# EAGLE design raspi3_nonHat (EAGLE 9.4.1)
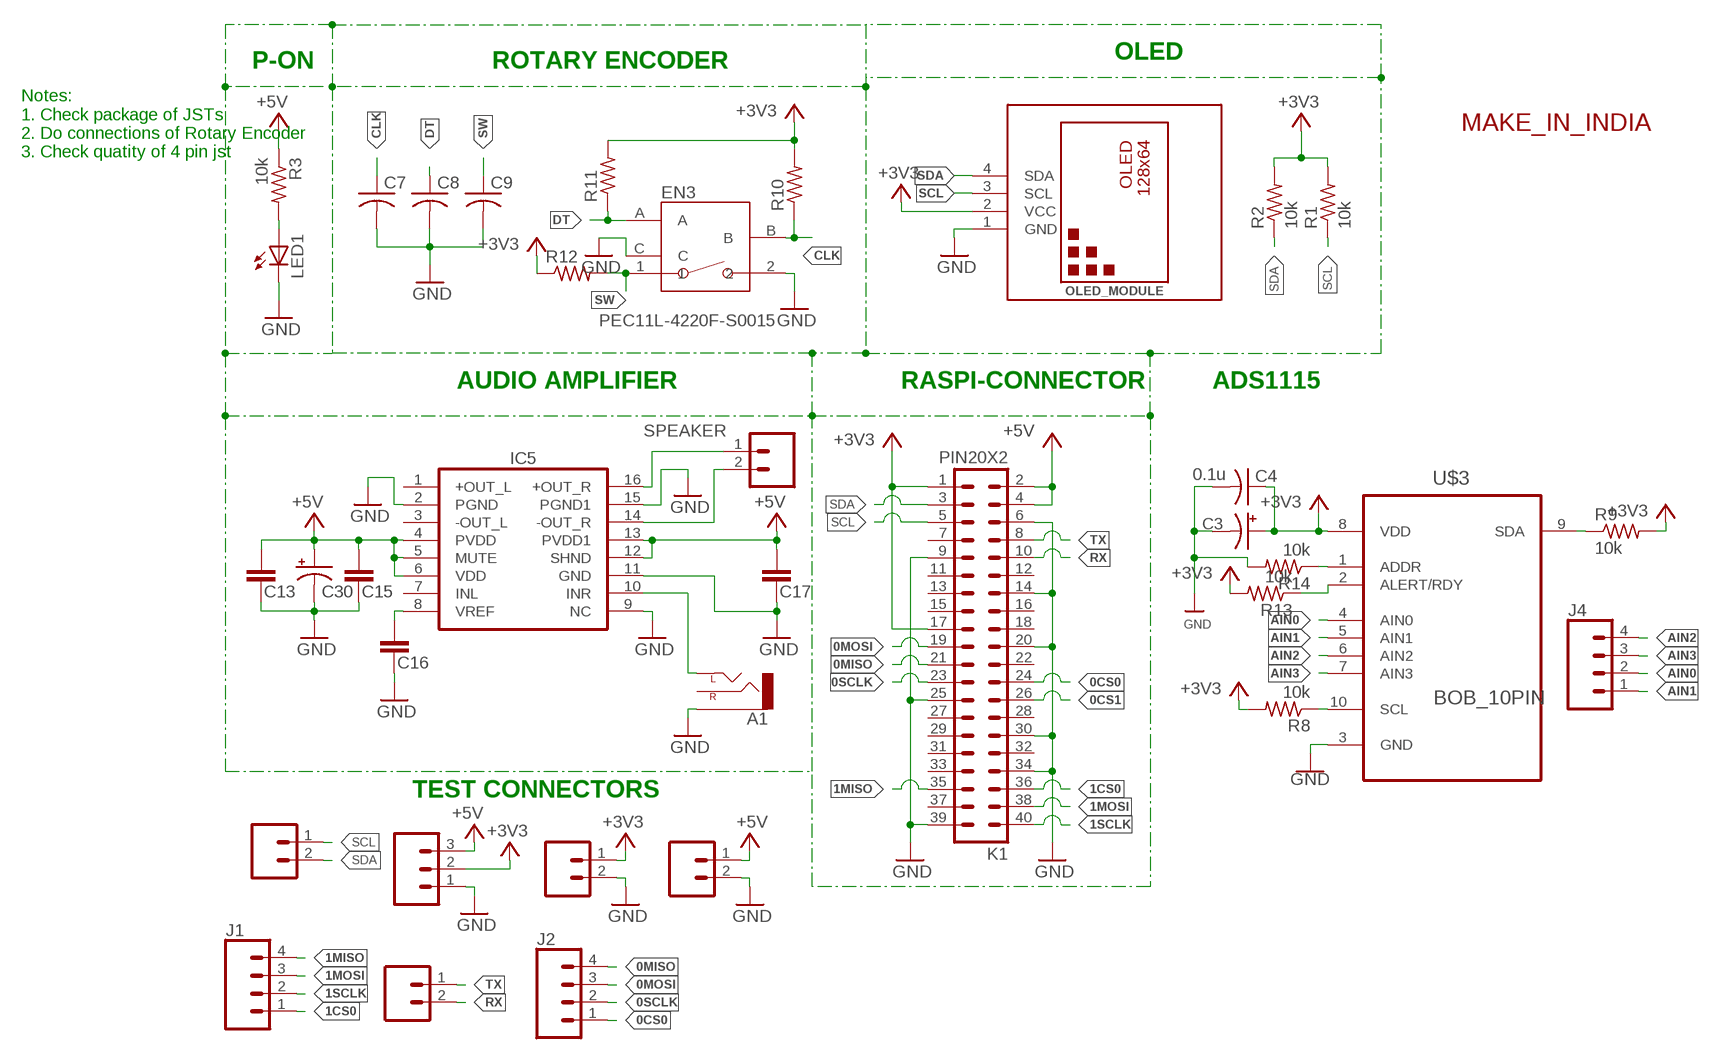
[diagram p0: schematic, sheet 1]

## Parts
A1  AUDIO-JACKPTH  [AUDIO-JACK]
C3  10u  CAP_POL_10V  [C/6032-28R]
C4  0.1u  CAP0805  [C0805]
C7  C-USC0603K  [C0603K]
C8  C-USC0603K  [C0603K]
C9  C-USC0603K  [C0603K]
C13  1uf  C-EUC1206  [C1206]
C15  1uf  C-EUC1206  [C1206]
C16  0.1uf  C-EUC1206  [C1206]
C17  1uf  C-EUC1206  [C1206]
C30  CAP_POL_10V  [C/6032-28R]
EN3  PEC11L-4220F-S0015  [PEC11L-4220F-S0015]
IC5  PAM8403  [SOP-16]
J1  CONN_04POLAR  [MOLEX-1X4]
J2  CONN_04POLAR  [MOLEX-1X4]
J4  CONN_04POLAR  [MOLEX-1X4]
K1  PIN20X2  [PIN_20X2]
LED1  LED3MM  [LED3MM]
OLED_MODULE  DIY-MODULES_DISPLAY-OLED-128X64-I2C  [DIY-MODULES_DISPLAY-OLED-128X64-I2C]
POWER  CONN_03POLAR  [MOLEX-1X3]
R1  10k  RESISTOR0207/7  [0207/7]
R2  10k  RESISTOR0207/7  [0207/7]
R3  10k  RESISTOR0207/7  [0207/7]
R8  10k  RESISTOR0603  [R0603]
R9  10k  RESISTOR0603  [R0603]
R10  R-US_M0805  [M0805]
R11  R-US_M0805  [M0805]
R12  R-US_M0805  [M0805]
R13  10k  RESISTOR0603  [R0603]
R14  10k  RESISTOR0603  [R0603]
SPEAKER  M02  [02P]
THERMISTOR1  CONN_02POLAR  [MOLEX-1X2]
THERMISTOR2  CONN_02POLAR  [MOLEX-1X2]
THERMISTOR3  CONN_02POLAR  [MOLEX-1X2]
THERMISTOR4  CONN_02POLAR  [MOLEX-1X2]
U$1  MAKE-IN-INDIA-LOGO  [MAKE-IN-INDIA]
U$3  BOB_10PIN  [BOB10]

## Nets
0CS0: J2.1 K1.24
0CS1: K1.26
0MISO: J2.4 K1.21
0MOSI: J2.3 K1.19
0SCLK: J2.2 K1.23
1CS0: J1.1 K1.36
1MISO: J1.4 K1.35
1MOSI: J1.3 K1.38
1SCLK: J1.2 K1.40
+3V3: C3.+ C4.1 K1.1 K1.17 OLED_MODULE.2(VCC) POWER.2 R1.2 R2.2 R8.2 R9.2 R10.2 R11.2 R12.1 R13.2 THERMISTOR2.1 U$3.8(VDD)
+5V: C13.1 C15.2 C17.2 C30.+ IC5.4(PVDD) IC5.5(MUTE) IC5.6(VDD) IC5.12(SHND) IC5.13(PVDD1) K1.2 K1.4 POWER.3 R3.1 THERMISTOR3.1
AIN0: J4.2 U$3.4(AIN0)
AIN1: J4.1 U$3.5(AIN1)
AIN2: J4.4 U$3.6(AIN2)
AIN3: J4.3 U$3.7(AIN3)
CLK: C7.1 EN3.B R10.1
DT: C8.1 EN3.A R11.1
GND: A1.SLEEVE C3.- C4.2 C7.2 C8.2 C9.2 C13.2 C15.1 C16.2 C17.1 C30.- EN3.2 EN3.C IC5.2(PGND) IC5.9(NC) IC5.11(GND) IC5.15(PGND1) K1.6 K1.9 K1.14 K1.20 K1.25 K1.30 K1.34 K1.39 LED1.K(C) OLED_MODULE.1(GND) POWER.1 R14.2 THERMISTOR2.2 THERMISTOR3.2 U$3.3(GND)
N$1: LED1.A R3.2
N$4: IC5.16(+OUT_R) SPEAKER.1
N$12: R8.1 U$3.10(SCL)
N$13: R9.1 U$3.9(SDA)
N$14: R13.1 U$3.2(ALERT/RDY)
N$15: R14.1 U$3.1(ADDR)
N$27: IC5.14(-OUT_R) SPEAKER.2
N$29: A1.TIP(LEFT) IC5.10(INR)
N$34: C16.1 IC5.8(VREF)
RX: K1.10 THERMISTOR4.2
SCL: K1.5 OLED_MODULE.3(SCL) R1.1 THERMISTOR1.1
SDA: K1.3 OLED_MODULE.4(SDA) R2.1 THERMISTOR1.2
SW: C9.1 EN3.1 R12.2
TX: K1.8 THERMISTOR4.1
Unconnected: A1.RING(RIGHT) IC5.1(+OUT_L) IC5.3(-OUT_L) IC5.7(INL) K1.7 K1.11 K1.12 K1.13 K1.15 K1.16 K1.18 K1.22 K1.27 K1.28 K1.29 K1.31 K1.32 K1.33 K1.37

## Notes on the sheet
- OLED
- P-ON | ROTARY ENCODER
- Notes:
  1. Check package of JSTs
  2. Do connections of Rotary Encoder
  3. Check quatity of 4 pin jst
- AUDIO AMPLIFIER | RASPI-CONNECTOR | ADS1115
- TEST CONNECTORS

## Library data of the parts
A1 = CEDT_JANUARY_2015_v5:AUDIO-JACK: 3.5mm Audio Jack Simple 3.5mm common PCB mount audio jack. SKU: PRT-08032
C3 = CEDT_JANUARY_2015_v5:CAP_POL
C4 = CEDT_JANUARY_2015_v5:CAP
C7-C9 = adafruit:C-US: CAPACITOR, American symbol
C13 C15-C17 = rcl:C-EU: CAPACITOR, European symbol
C30 = CEDT_SEPTEMBER_V2:CAP_POL
EN3 = Encoders:PEC11L-4220F-S0015: ROTARY ENCODER MECHANICAL 15PPR Manufacturer's datasheet <https://www.bourns.com/docs/Product-Datasheets/PEC11L.pdf>; CREATED_BY: PCBLayout.com; DIGIKEY_PARTNO: PEC11L-4220F-S0015-ND; MANUFACTURER: Bourns Inc.; MPN: PEC11L-4220F-S0015
IC5 = PAM8403:PAM8403: Dual channel audio amplifier IC - PAM8403
J1 J2 J4 = SparkFun-Connectors:CONN_04: Multi connection point. Often used as Generic Header-pin footprint for 0.1 inch spaced/style header connections On any of the 0.1 inch spaced packages, you can populate with these: Break Away Headers - Straight <https://www.sparkfun.com/products/116> (PRT-00116) Break Away Male Headers - Right Angle <https://www.sparkfun.com/products/553> (PRT-00553) Female Headers <https://www.sparkfun.com/products/115> (PRT-00115) Break Away Headers - Machine Pin <https://www.sparkfun.com/products/117> (PRT-00117) Break Away Female Headers - Swiss Machine Pin <https://www.sparkfun.com/products/743> (PRT-00743) For SCREWTERMINALS and SPRING TERMINALS visit here: Screw Terimnals on SparkFun.com <https://www.sparkfun.com/search/results?term=Screw+Terminals> (5mm/3.5mm/2.54mm spacing) This device is also useful as a general connection point to wire up your design to another part of your project. Our various solder wires solder well into these plated through hole pads. Hook-Up Wire - Assortment (Stranded, 22 AWG) <https://www.sparkfun.com/products/11375> (PRT-11375) Hook-Up Wire - Assortment (Solid Core, 22 AWG) <https://www.sparkfun.com/products/11367> (PRT-11367) View the entire wire category on our website here <https://www.sparkfun.com/categories/141> Special notes: Molex polarized connector foot print use with SKU : PRT-08231 with associated crimp pins and housings. 1MM SMD Version SKU: PRT-10208; PROD_ID: CONN-08186; SF_ID: PRT-08231
K1 = FLYFISH:PIN20X2
LED1 = CEDT_JANUARY_2015_v5:LED
OLED_MODULE = esp32_dev_kit_v14:DIY-MODULES_DISPLAY-OLED-128X64-I2C: 128x64 Dot Matrix OLED Module based on SSD1306 chip Variant with I2C interface More details available here: http://www.instructables.com/id/Monochrome-096-i2c-OLED-display-with-arduino-SSD13/ SSD1306 datasheet: https://cdn-shop.adafruit.com/datasheets/SSD1306.pdf Click here to find device on ebay.com <http://www.ebay.com/sch/oled+display+128x64+iic> Note: There are two variants: I2C and SPI. Search for the proper version.
POWER = SparkFun-Connectors:CONN_03: Multi connection point. Often used as Generic Header-pin footprint for 0.1 inch spaced/style header connections On any of the 0.1 inch spaced packages, you can populate with these: Break Away Headers - Straight <https://www.sparkfun.com/products/116> (PRT-00116) Break Away Male Headers - Right Angle <https://www.sparkfun.com/products/553> (PRT-00553) Female Headers <https://www.sparkfun.com/products/115> (PRT-00115) Break Away Headers - Machine Pin <https://www.sparkfun.com/products/117> (PRT-00117) Break Away Female Headers - Swiss Machine Pin <https://www.sparkfun.com/products/743> (PRT-00743) Stackable Header - 3 Pin (Female, 0.1") <https://www.sparkfun.com/products/13875> (PRT-13875) For SCREWTERMINALS and SPRING TERMINALS visit here: Screw Terimnals on SparkFun.com <https://www.sparkfun.com/search/results?term=Screw+Terminals> (5mm/3.5mm/2.54mm spacing) This device is also useful as a general connection point to wire up your design to another part of your project. Our various solder wires solder well into these plated through hole pads. Hook-Up Wire - Assortment (Stranded, 22 AWG) <https://www.sparkfun.com/products/11375> (PRT-11375) Hook-Up Wire - Assortment (Solid Core, 22 AWG) <https://www.sparkfun.com/products/11367> (PRT-11367) View the entire wire category on our website here <https://www.sparkfun.com/categories/141> Special notes: Molex polarized connector foot print use with SKU : PRT-08232 with associated crimp pins and housings.; PROD_ID: CONN-08625; SF_ID: PRT-08096
R1-R3 = CEDT:RESISTOR; OC_FARNELL: unknown
R8 R9 R13 R14 = CEDT_JANUARY_2015_v5:RESISTOR
R10-R12 = rcl:R-US_: RESISTOR, American symbol; SPICEPREFIX: R
SPEAKER = CEDT_JANUARY_2015_v5:M02: AMP QUICK CONNECTOR
THERMISTOR1-THERMISTOR4 = SparkFun-Connectors:CONN_02: Multi connection point. Often used as Generic Header-pin footprint for 0.1 inch spaced/style header connections On any of the 0.1 inch spaced packages, you can populate with these: Break Away Headers - Straight <https://www.sparkfun.com/products/116> (PRT-00116) Break Away Male Headers - Right Angle <https://www.sparkfun.com/products/553> (PRT-00553) Female Headers <https://www.sparkfun.com/products/115> (PRT-00115) Break Away Headers - Machine Pin <https://www.sparkfun.com/products/117> (PRT-00117) Break Away Female Headers - Swiss Machine Pin <https://www.sparkfun.com/products/743> (PRT-00743) For SCREWTERMINALS and SPRING TERMINALS visit here: Screw Terimnals on SparkFun.com <https://www.sparkfun.com/search/results?term=Screw+Terminals> (5mm/3.5mm/2.54mm spacing) This device is also useful as a general connection point to wire up your design to another part of your project. Our various solder wires solder well into these plated through hole pads. Hook-Up Wire - Assortment (Stranded, 22 AWG) <https://www.sparkfun.com/products/11375> (PRT-11375) Hook-Up Wire - Assortment (Solid Core, 22 AWG) <https://www.sparkfun.com/products/11367> (PRT-11367) View the entire wire category on our website here <https://www.sparkfun.com/categories/141> Special notes: Molex polarized connector foot print use with: PRT-08233 with associated crimp pins and housings. 2.54_SCREWTERM for use with PRT-10571. 3.5mm Screw Terminal footprints for PRT-08084 5mm Screw Terminal footprints for use with PRT-08432; SF_ID: PRT-09918
U$1 = namanpuri:MAKE-IN-INDIA-LOGO
U$3 = CEDT_JANUARY_2015_v5:BOB_10PIN

## Board
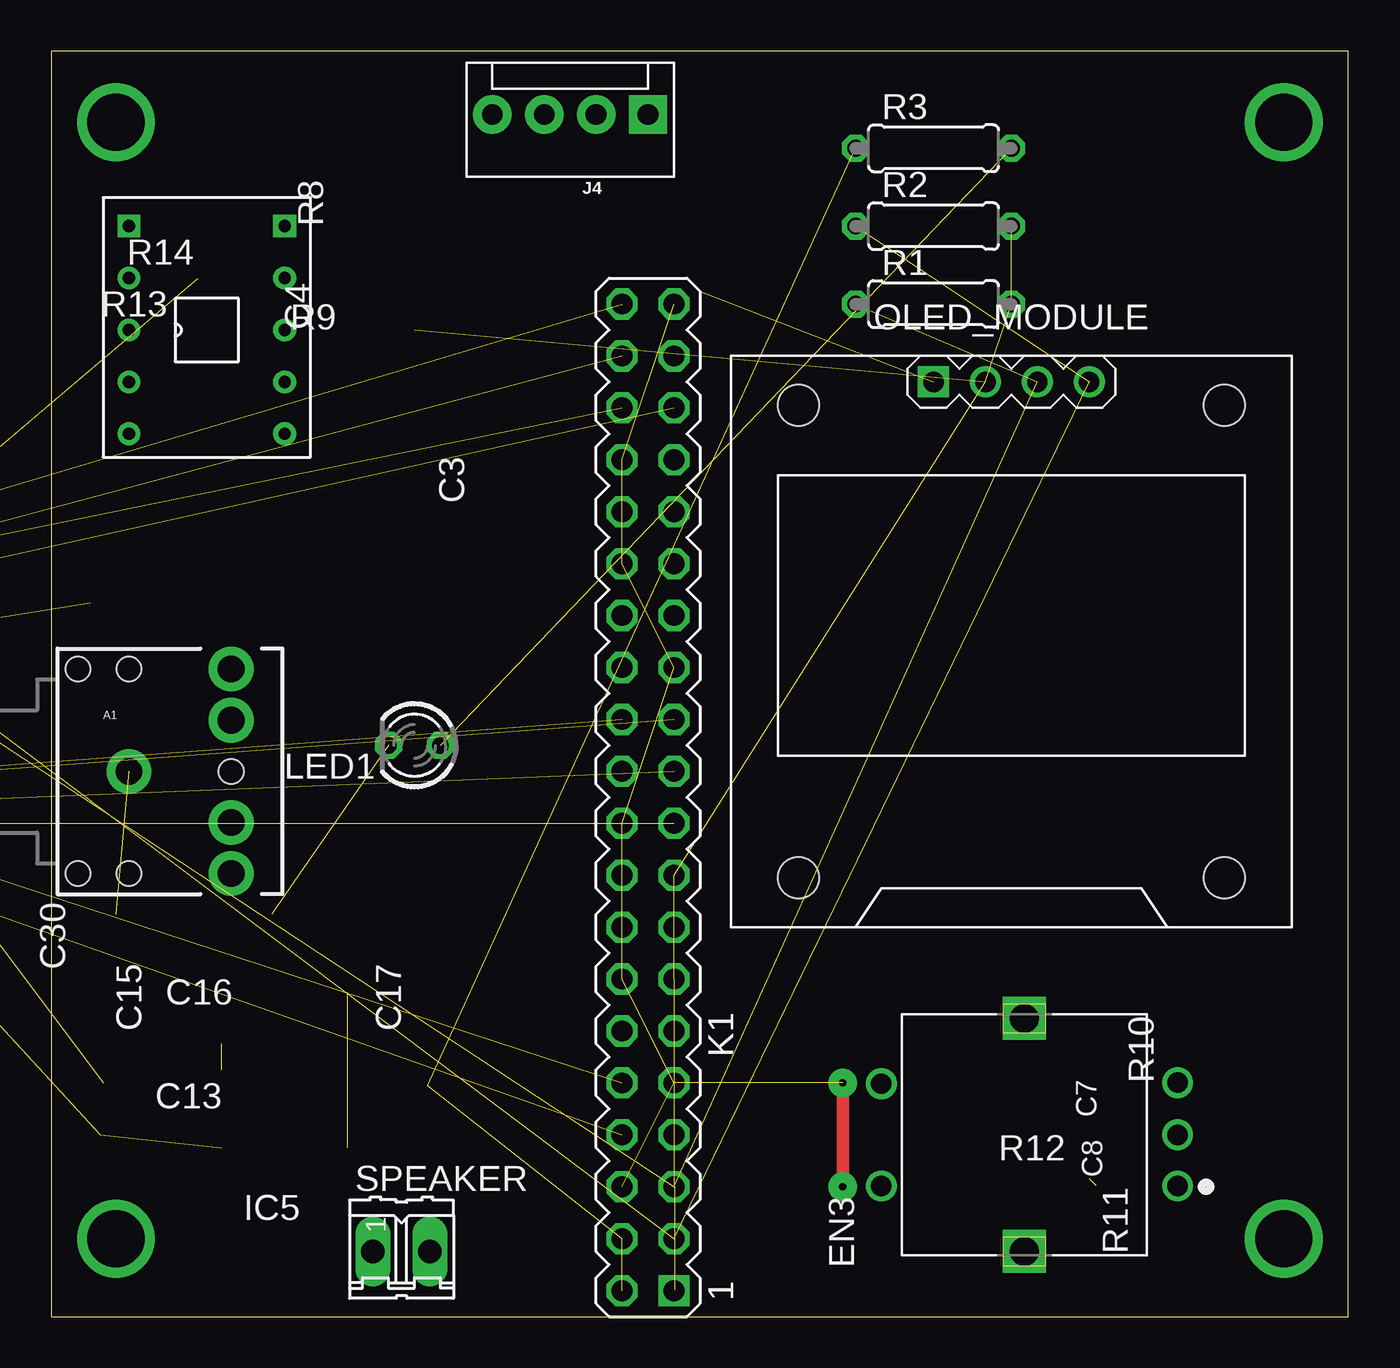
[diagram p1: board, top side]
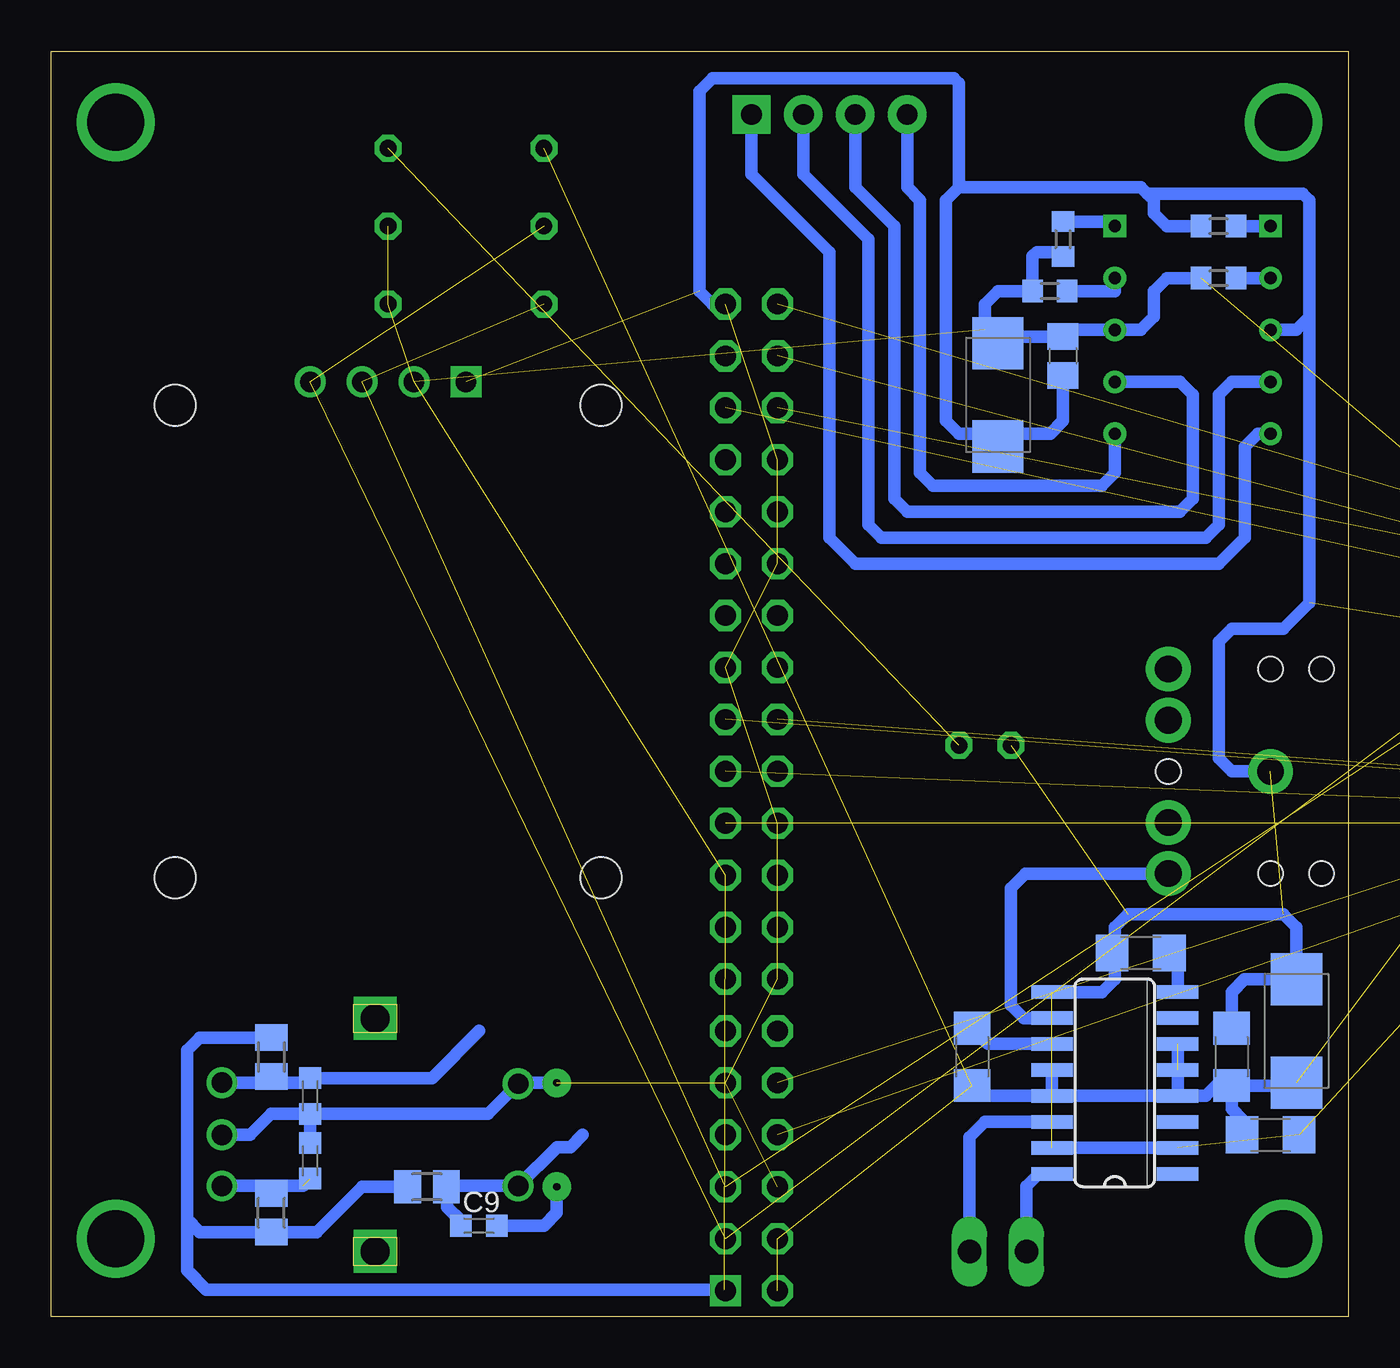
[diagram p2: board, bottom side, seen from below]

Size 63.48 x 61.9 mm. Coordinates in mm from the lower left corner, seen from the top.
Outline: 0,0 63.48,0 63.48,61.9 0,61.9 0,0
Copper layers (1*16): Top 0.035mm / dielectric 1.5mm / Bottom 0.035mm
Design rules "default": minimum track width 6mil, minimum drill 0.35mm, track to track 6mil, track to pad 6mil, pad to pad 6mil, via to via 6mil, smd to smd 6mil, copper to edge 40mil, drill to drill 6mil, minimum pad ring 10mil, minimum via ring 8mil, stop-mask expansion 4mil, vias tented up to drill 0mil, thermal gap 10mil

### Footprints (pad centres in the part's own frame; a part is rotated, then mirrored left to right if it is on the bottom)
AUDIO-JACK = drill 1.3 pad 2.184: RING 5,5; RSH 5,2.5; SLEEVE 0,0; TIP 5,-5; TSH 5,-2.5 | hole 1.2: 0,5; -2.5,5; -2.5,-5; 0,-5; 5,0
C/6032-28R = smd 2.55 x 2.5: + 2.525,0; - -2.525,0
C0805 = smd 1.3 x 1.5: 1 -0.95,0; 2 0.95,0
C0603K = smd 1.05 x 1.08: 1 -0.875,0; 2 0.875,0
C1206 = smd 1.6 x 1.8: 1 -1.4,0; 2 1.4,0
PEC11L-4220F-S0015 = drill 1: 1 -2.5,7; 2 2.5,7; A -2.5,-7.5; B 2.55,-7.5; C 0,-7.5 | drill 1.4 square: M1 -5.7,0; M2 5.7,0
SOP-16 = smd 0.66 x 2.032: 1 -4.445,-3.073; 2 -3.175,-3.073; 3 -1.905,-3.073; 4 -0.635,-3.073; 5 0.635,-3.073; 6 1.905,-3.073; 7 3.175,-3.073; 8 4.445,-3.073; 9 4.445,3.073; 10 3.175,3.073; 11 1.905,3.073; 12 0.635,3.073; 13 -0.635,3.073; 14 -1.905,3.073; 15 -3.175,3.073; 16 -4.445,3.073
MOLEX-1X4 = drill 1.016 pad 1.88 square: 1 0,0 | drill 1.016 pad 1.88: 2 2.54,0; 3 5.08,0; 4 7.62,0
PIN_20X2 = drill 1.016 square: 1 -24.13,-1.27 | drill 1.016 octagon: 2 -24.13,1.27; 3 -21.59,-1.27; 4 -21.59,1.27; 5 -19.05,-1.27; 6 -19.05,1.27; 7 -16.51,-1.27; 8 -16.51,1.27; 9 -13.97,-1.27; 10 -13.97,1.27; 11 -11.43,-1.27; 12 -11.43,1.27; 13 -8.89,-1.27; 14 -8.89,1.27; 15 -6.35,-1.27; 16 -6.35,1.27; 17 -3.81,-1.27; 18 -3.81,1.27; 19 -1.27,-1.27; 20 -1.27,1.27; 21 1.27,-1.27; 22 1.27,1.27; 23 3.81,-1.27; 24 3.81,1.27; 25 6.35,-1.27; 26 6.35,1.27; 27 8.89,-1.27; 28 8.89,1.27; 29 11.43,-1.27; 30 11.43,1.27; 31 13.97,-1.27; 32 13.97,1.27; 33 16.51,-1.27; 34 16.51,1.27; 35 19.05,-1.27; 36 19.05,1.27; 37 21.59,-1.27; 38 21.59,1.27; 39 24.13,-1.27; 40 24.13,1.27
LED3MM = drill 0.813 octagon: A -1.27,0; K 1.27,0
DIY-MODULES_DISPLAY-OLED-128X64-I2C = drill 1 square: 1 -3.81,12.7 | drill 1: 2 -1.27,12.7; 3 1.27,12.7; 4 3.81,12.7 | hole 2: -10.414,11.557; 10.414,11.557; 10.414,-11.557; -10.414,-11.557
MOLEX-1X3 = drill 1.016 pad 1.88 square: 1 0,0 | drill 1.016 pad 1.88: 2 2.54,0; 3 5.08,0
0207/7 = drill 0.813 octagon: 1 -3.81,0; 2 3.81,0
R0603 = smd 1 x 1.1: 1 -0.85,0; 2 0.85,0
M0805 = smd 1.3 x 1.6: 1 -0.95,0; 2 0.95,0
02P = drill 1.143 long: 1 -1.397,0; 2 1.397,0
MOLEX-1X2 = drill 1.016 pad 1.88 square: 1 0,0 | drill 1.016 pad 1.88: 2 2.54,0
BOB10 = drill 0.6 square: 1 -3.81,5.08; 10 3.81,5.08 | drill 0.6: 2 -3.81,2.54; 3 -3.81,0; 4 -3.81,-2.54; 5 -3.81,-5.08; 6 3.81,-5.08; 7 3.81,-2.54; 8 3.81,0; 9 3.81,2.54

### Placement (x,y rotation side)
A1  3.81,26.67 0 top
C3  17.15,45.09 90 bottom
C4  13.97,46.99 270 bottom
C7  50.8,10.79 270 bottom
C8  50.8,7.62 90 bottom
C9  42.55,4.45 0 bottom
C13  3.81,8.89 0 bottom
C15  5.71,12.7 270 bottom
C16  10.16,17.78 180 bottom
C17  18.41,12.7 270 bottom
C30  2.54,13.97 270 bottom
EN3  47.62,8.89 90 top
IC5  11.43,11.43 90 bottom
J1  -34.29,31.75 0 top  (outside the outline)
J2  -40.64,24.13 0 top  (outside the outline)
J4  29.21,58.8 180 top
K1  29.21,25.4 90 top
LED1  17.78,27.94 180 top
OLED_MODULE  46.99,33.02 0 top
POWER  -17.78,31.75 0 top  (outside the outline)
R1  43.18,49.53 0 top
R2  43.18,53.34 0 top
R3  43.18,57.15 0 top
R8  13.97,52.71 270 bottom
R9  14.61,50.17 180 bottom
R10  52.7,12.7 90 bottom
R11  52.7,5.08 270 bottom
R12  45.08,6.35 0 bottom
R13  6.35,50.8 180 bottom
R14  6.35,53.34 180 bottom
SPEAKER  17.15,3.17 0 top
THERMISTOR1  -17.78,38.1 0 top  (outside the outline)
THERMISTOR2  -30.48,41.91 0 top  (outside the outline)
THERMISTOR3  -36.83,41.91 0 top  (outside the outline)
THERMISTOR4  -40.64,33.02 0 top  (outside the outline)
U$1  -29.21,15.24 0 top  (outside the outline)
U$3  7.62,48.26 0 top

### Tracks (layer width: path | path; a pad name or v marks a point on that pad's centre or on a via)
0CS0  (1 unrouted)
0MISO  (1 unrouted)
0MOSI  (1 unrouted)
0SCLK  (1 unrouted)
1CS0  (1 unrouted)
1MISO  (1 unrouted)
1MOSI  (1 unrouted)
1SCLK  (1 unrouted)
+3V3  (7 unrouted)
  Bottom 0.61: 56.83,4.77 56.83,13.02 56.2,13.65 R10.2 | 56.83,4.77 56.2,4.13 R11.2 50.48,4.13 48.26,6.35 R12.1 | K1.1 30.53,1.32 55.88,1.32 56.83,2.27 56.83,4.77 | 17.14,47.62 16.81,47.94 C4.1 13.65,48.26 U$3.8 10.16,48.26 9.52,48.9 9.52,50.17 8.89,50.8 R13.2 | 17.14,47.62 C3.+ | R8.2 14.19,52.07 15.24,52.07 15.45,51.86 R9.2 | 15.24,50.38 R9.2 | R9.2 17.15,50.17 17.78,49.53 17.78,48.26 17.14,47.62
+5V  (6 unrouted)
  Bottom 0.61: IC5.4 IC5.6 | IC5.4 6.98,10.79 6.35,11.43 5.84,11.43 C15.2 | C13.1 5.21,9.65 5.71,10.16 C15.2 | C15.2 2.69,11.3 C30.+ | IC5.13 IC5.12 | C17.2 18,10.88 17.65,10.79 IC5.13 | IC5.13 IC5.4
AIN0
  Bottom 0.61: J4.2 26.67,55.88 23.49,52.71 23.49,38.74 22.86,38.1 6.98,38.1 6.35,38.74 6.35,45.09 5.71,45.72 U$3.4
AIN1
  Bottom 0.61: J4.1 29.21,55.88 25.4,52.07 25.4,38.1 24.13,36.83 6.35,36.83 5.08,38.1 5.08,42.55 4.45,43.18 U$3.5
AIN2
  Bottom 0.61: U$3.6 11.43,41.28 12.06,40.64 20.32,40.64 20.95,41.28 20.95,54.61 21.59,55.25 J4.4
AIN3
  Bottom 0.61: U$3.7 8.25,45.72 7.62,45.09 7.62,40.01 8.25,39.37 21.59,39.37 22.23,40.01 22.23,53.34 24.13,55.25 J4.3
CLK
  Bottom 0.61: EN3.B 52.39,11.44 | 52.39,11.44 51.03,11.44 C7.1 44.84,11.67 42.55,13.97 | R10.1 52.39,11.44
DT  (1 unrouted)
  Bottom 0.61: EN3.A 53.06,6.39 | 53.06,6.39 51.16,6.39 | R11.1 53.06,6.39
GND  (via drill 0.35 pad 1.4)  (17 unrouted)
  Top 0.61: v38.73,6.35 v38.73,11.43
  Bottom 0.61: C15.1 5.71,15.88 5.09,16.5 C30.- 2.54,19.05 3.18,19.68 10.8,19.68 11.43,19.05 11.43,17.91 C16.2 11.43,17.65 11.43,16.51 12.06,15.88 IC5.9 | IC5.15 IC5.2 | C17.1 17.65,13.33 IC5.11 | C8.2 C7.2 | EN3.C 53.73,8.89 52.7,9.92 C7.2 | C7.2 42.09,9.92 EN3.2 40.59,11.43 v38.73,11.43 | C9.2 39.37,4.45 38.73,5.08 v38.73,6.35 | C4.2 13.97,43.82 14.59,43.2 16.51,43.2 16.51,42.56 | 16.51,42.56 C3.- 17.77,43.18 19.05,43.18 19.69,43.82 19.69,54.61 19.05,55.25 | 16.51,42.55 16.51,42.56 | R14.2 8.89,53.34 9.52,53.98 9.52,54.61 9.84,54.93 | 9.84,54.93 10.16,55.25 19.05,55.25 | U$3.3 2.54,48.26 1.91,48.9 | 1.91,48.9 1.91,54.61 2.22,54.93 9.84,54.93 | A1.SLEEVE 5.71,26.67 6.35,27.3 6.35,33.02 5.71,33.66 3.18,33.66 1.91,34.93 1.91,48.9 | 19.05,55.25 19.05,60.33 19.3,60.58 31.12,60.58 31.75,59.94 31.75,50.17 31.12,49.53 K1.39
N$1  (1 unrouted)
N$3  (via drill 2.79 pad 3.81)
  other vias: 3.18,58.42
N$4
  Bottom 0.61: IC5.16 15.14,6.98 15.75,6.38 SPEAKER.1
N$5  (via drill 2.79 pad 3.81)
  other vias: 60.33,58.42
N$6  (via drill 2.79 pad 3.81)
  other vias: 60.33,3.81
N$7  (via drill 2.79 pad 3.81)
  other vias: 3.18,3.81
N$12
  Bottom 0.61: U$3.10 11.65,53.55 R8.1
N$13
  Bottom 0.61: U$3.9 11.43,50.17 R9.1
N$14
  Bottom 0.61: U$3.2 R13.1
N$15
  Bottom 0.61: U$3.1 R14.1
N$27
  Bottom 0.61: IC5.14 17.78,9.53 18.54,8.76 SPEAKER.2
N$29
  Bottom 0.61: IC5.10 15.88,14.61 16.51,15.24 16.51,20.95 15.8,21.67 A1.TIP
N$34
  Bottom 0.61: IC5.8 8.36,17.38 C16.1
RX  (1 unrouted)
SCL  (3 unrouted)
SDA  (3 unrouted)
SW
  Bottom 0.61: 44.09,6.39 EN3.1 38.72,8.29 38.06,8.29 37.47,8.89 | 44.09,6.39 R12.2 | C9.1 43.42,4.69 44.09,5.36 44.09,6.39
TX  (1 unrouted)